# EAGLE schematic TD4SMD (EAGLE 8.0.2)
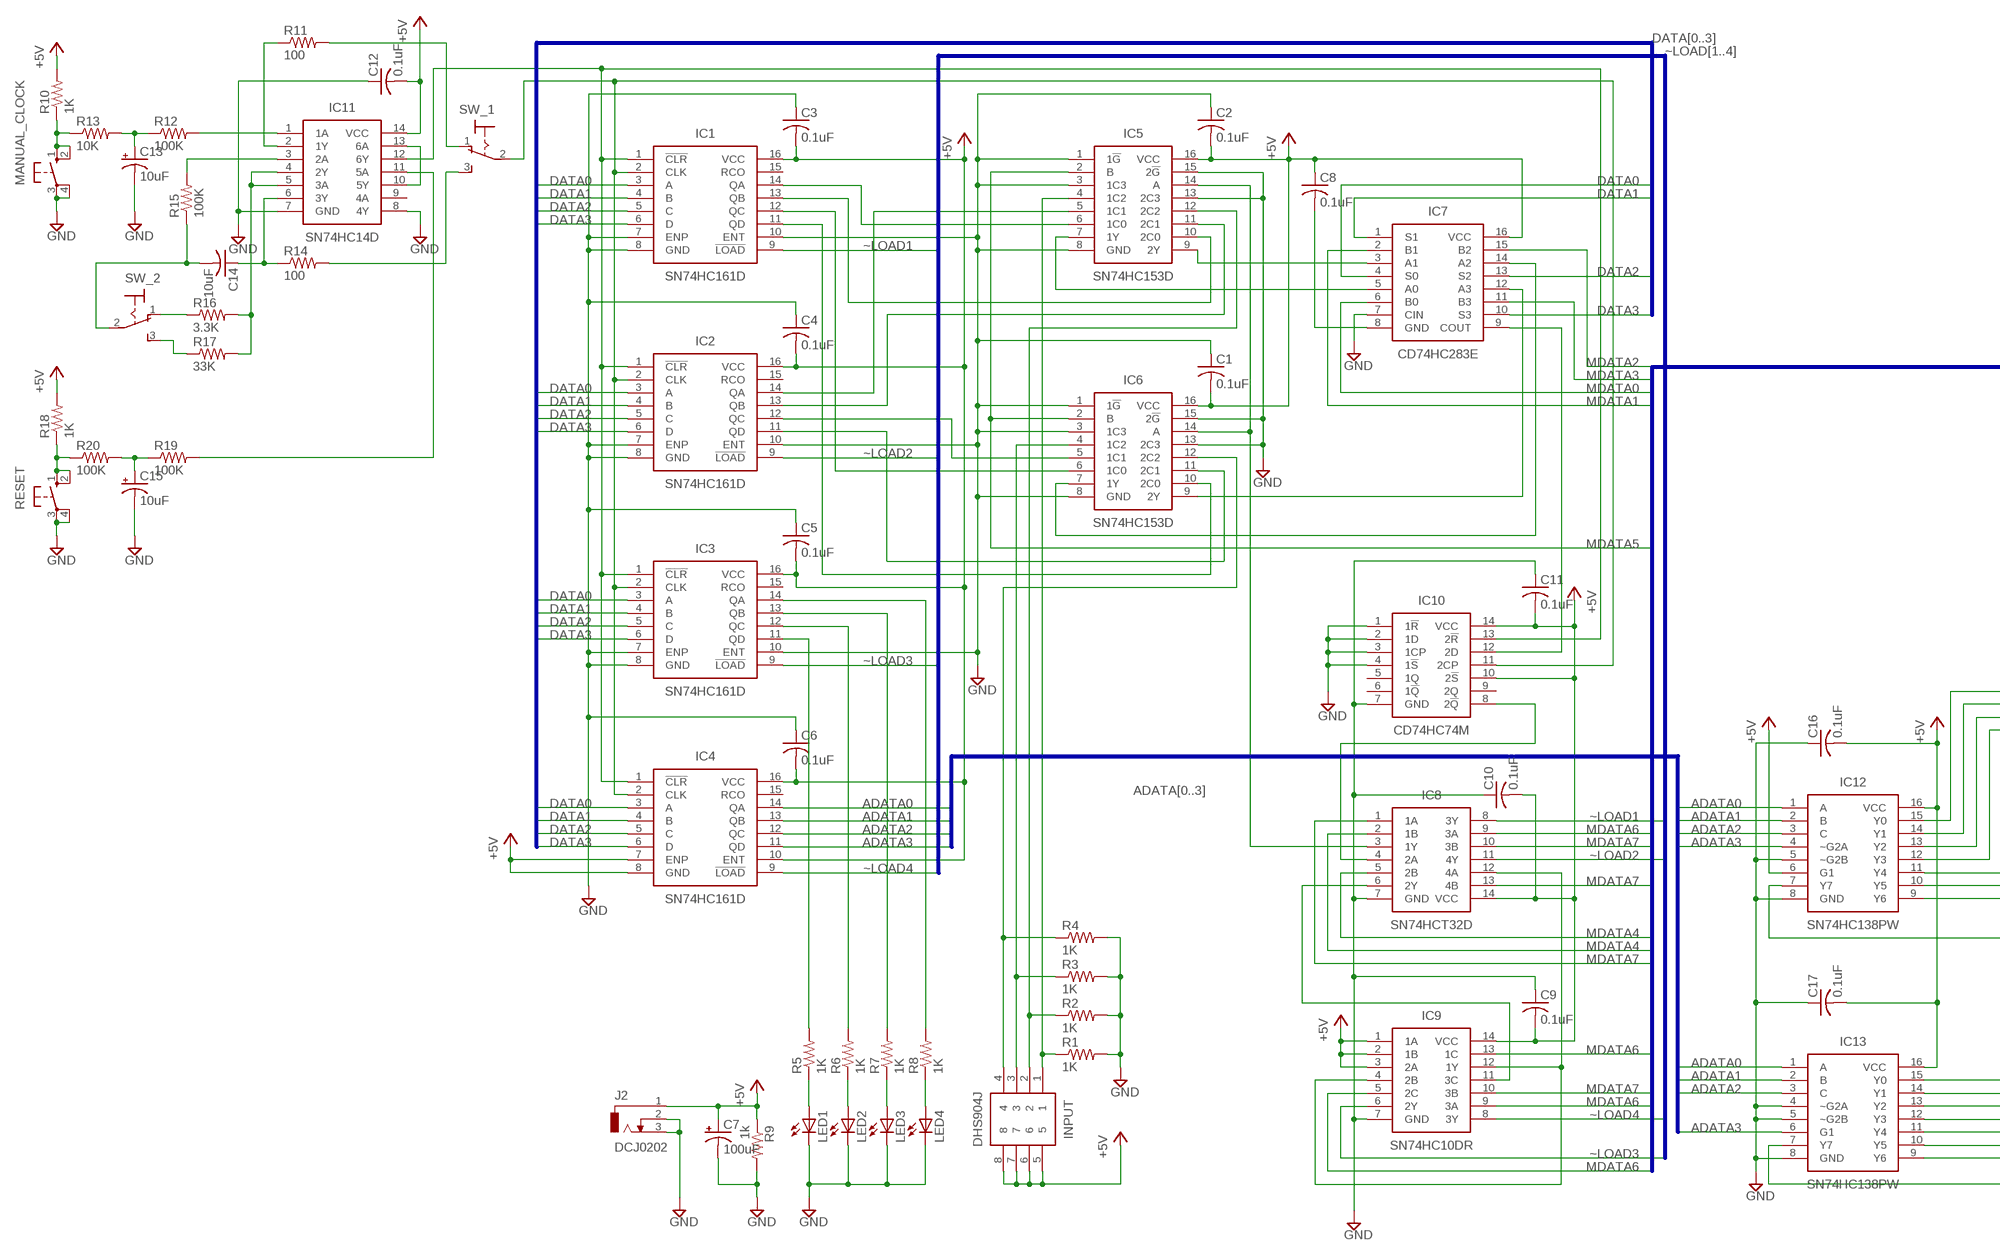
[diagram p0: schematic, sheet 1, part 1 of 2]
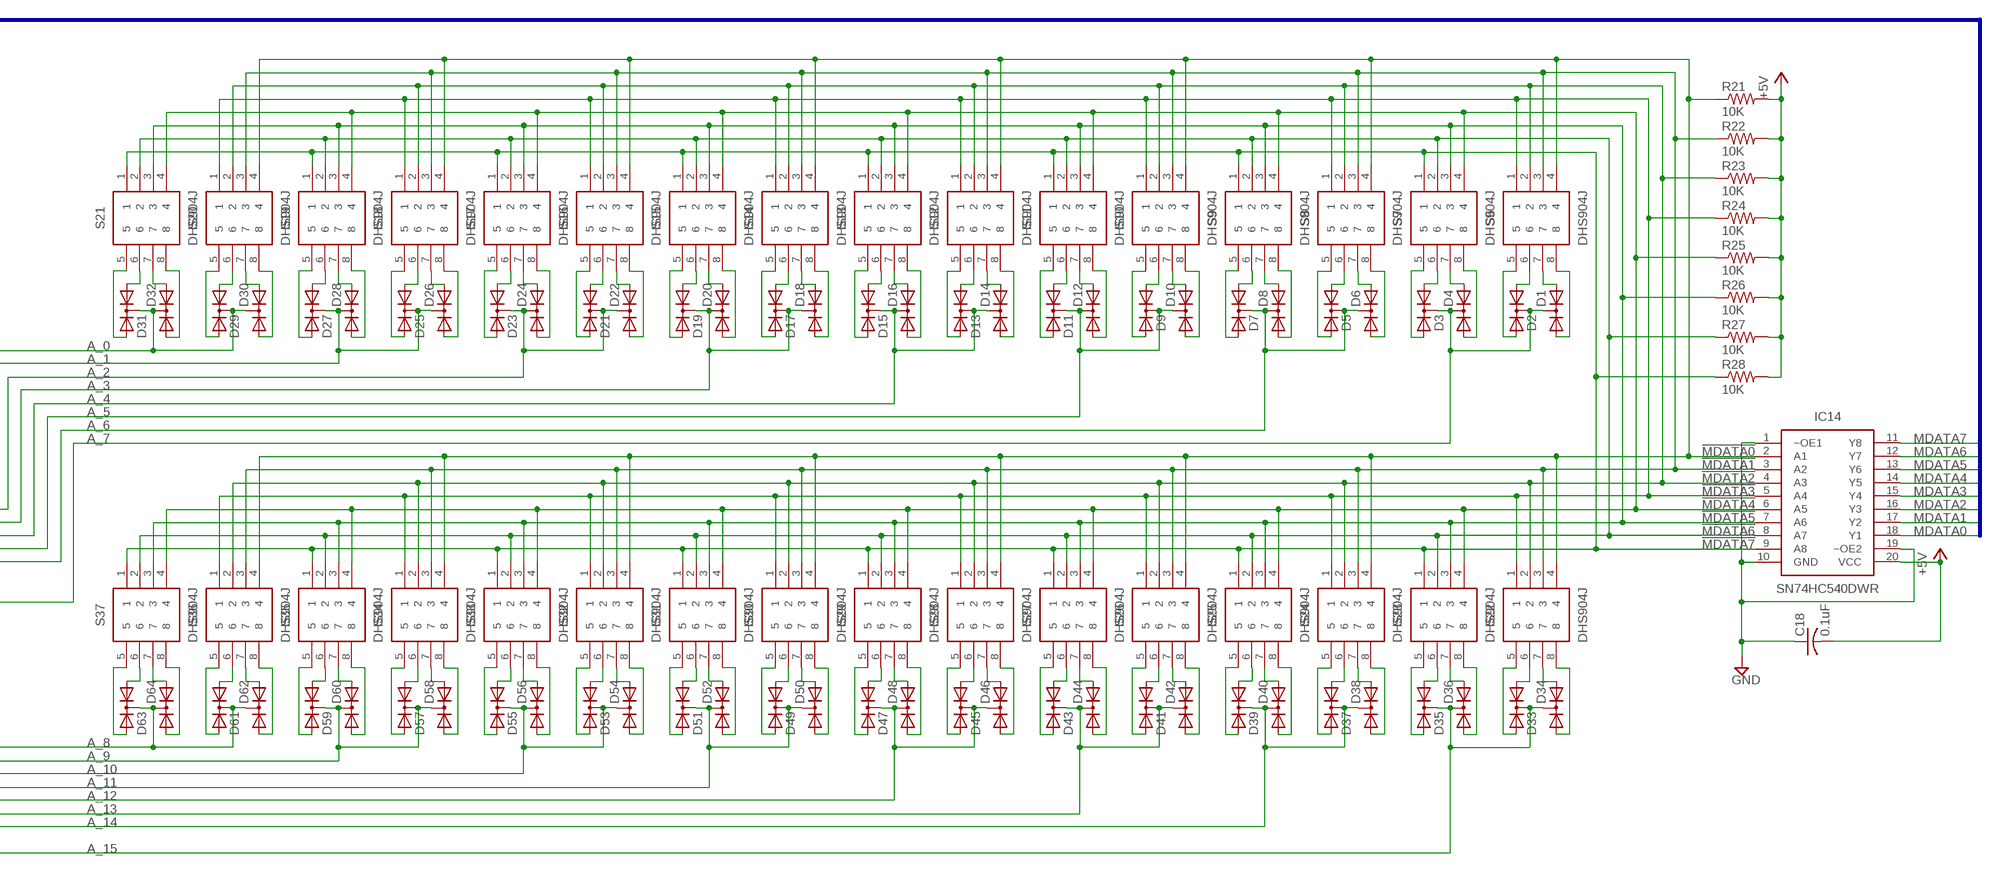
[diagram p1: schematic, sheet 1, part 2 of 2]

## Parts
C1  0.1uF  C-USC0603  [C0603]
C2  0.1uF  C-USC0603  [C0603]
C3  0.1uF  C-USC0603  [C0603]
C4  0.1uF  C-USC0603  [C0603]
C5  0.1uF  C-USC0603  [C0603]
C6  0.1uF  C-USC0603  [C0603]
C7  100uF  CPOL-USE2.5-7  [E2,5-7]
C8  0.1uF  C-USC0603  [C0603]
C9  0.1uF  C-USC0603  [C0603]
C10  0.1uF  C-USC0603  [C0603]
C11  0.1uF  C-USC0603  [C0603]
C12  0.1uF  C-USC0603  [C0603]
C13  10uF  CPOL-USE2.5-7  [E2,5-7]
C14  10uF  C-US025-060X050  [C025-060X050]
C15  10uF  CPOL-USE2.5-7  [E2,5-7]
C16  0.1uF  C-USC0603  [C0603]
C17  0.1uF  C-USC0603  [C0603]
C18  0.1uF  C-USC0603  [C0603]
D1  DIODE-2AC|CASOT23  [SOT23]
D2  DIODE-2AC|CASOT23  [SOT23]
D3  DIODE-2AC|CASOT23  [SOT23]
D4  DIODE-2AC|CASOT23  [SOT23]
D5  DIODE-2AC|CASOT23  [SOT23]
D6  DIODE-2AC|CASOT23  [SOT23]
D7  DIODE-2AC|CASOT23  [SOT23]
D8  DIODE-2AC|CASOT23  [SOT23]
D9  DIODE-2AC|CASOT23  [SOT23]
D10  DIODE-2AC|CASOT23  [SOT23]
D11  DIODE-2AC|CASOT23  [SOT23]
D12  DIODE-2AC|CASOT23  [SOT23]
D13  DIODE-2AC|CASOT23  [SOT23]
D14  DIODE-2AC|CASOT23  [SOT23]
D15  DIODE-2AC|CASOT23  [SOT23]
D16  DIODE-2AC|CASOT23  [SOT23]
D17  DIODE-2AC|CASOT23  [SOT23]
D18  DIODE-2AC|CASOT23  [SOT23]
D19  DIODE-2AC|CASOT23  [SOT23]
D20  DIODE-2AC|CASOT23  [SOT23]
D21  DIODE-2AC|CASOT23  [SOT23]
D22  DIODE-2AC|CASOT23  [SOT23]
D23  DIODE-2AC|CASOT23  [SOT23]
D24  DIODE-2AC|CASOT23  [SOT23]
D25  DIODE-2AC|CASOT23  [SOT23]
D26  DIODE-2AC|CASOT23  [SOT23]
D27  DIODE-2AC|CASOT23  [SOT23]
D28  DIODE-2AC|CASOT23  [SOT23]
D29  DIODE-2AC|CASOT23  [SOT23]
D30  DIODE-2AC|CASOT23  [SOT23]
D31  DIODE-2AC|CASOT23  [SOT23]
D32  DIODE-2AC|CASOT23  [SOT23]
D33  DIODE-2AC|CASOT23  [SOT23]
D34  DIODE-2AC|CASOT23  [SOT23]
D35  DIODE-2AC|CASOT23  [SOT23]
D36  DIODE-2AC|CASOT23  [SOT23]
D37  DIODE-2AC|CASOT23  [SOT23]
D38  DIODE-2AC|CASOT23  [SOT23]
D39  DIODE-2AC|CASOT23  [SOT23]
D40  DIODE-2AC|CASOT23  [SOT23]
D41  DIODE-2AC|CASOT23  [SOT23]
D42  DIODE-2AC|CASOT23  [SOT23]
D43  DIODE-2AC|CASOT23  [SOT23]
D44  DIODE-2AC|CASOT23  [SOT23]
D45  DIODE-2AC|CASOT23  [SOT23]
D46  DIODE-2AC|CASOT23  [SOT23]
D47  DIODE-2AC|CASOT23  [SOT23]
D48  DIODE-2AC|CASOT23  [SOT23]
D49  DIODE-2AC|CASOT23  [SOT23]
D50  DIODE-2AC|CASOT23  [SOT23]
D51  DIODE-2AC|CASOT23  [SOT23]
D52  DIODE-2AC|CASOT23  [SOT23]
D53  DIODE-2AC|CASOT23  [SOT23]
D54  DIODE-2AC|CASOT23  [SOT23]
D55  DIODE-2AC|CASOT23  [SOT23]
D56  DIODE-2AC|CASOT23  [SOT23]
D57  DIODE-2AC|CASOT23  [SOT23]
D58  DIODE-2AC|CASOT23  [SOT23]
D59  DIODE-2AC|CASOT23  [SOT23]
D60  DIODE-2AC|CASOT23  [SOT23]
D61  DIODE-2AC|CASOT23  [SOT23]
D62  DIODE-2AC|CASOT23  [SOT23]
D63  DIODE-2AC|CASOT23  [SOT23]
D64  DIODE-2AC|CASOT23  [SOT23]
IC1  SN74HC161D  [SOIC127P600X175-16N]
IC2  SN74HC161D  [SOIC127P600X175-16N]
IC3  SN74HC161D  [SOIC127P600X175-16N]
IC4  SN74HC161D  [SOIC127P600X175-16N]
IC5  SN74HC153D  [SOIC127P600X175-16N]
IC6  SN74HC153D  [SOIC127P600X175-16N]
IC7  CD74HC283E  [DIP794W53P254L1930H508Q16N]
IC8  SN74HCT32D  [SOIC127P600X175-14N]
IC9  SN74HC10DR  [SOIC127P600X175-14N]
IC10  CD74HC74M  [SOIC127P600X175-14N]
IC11  SN74HC14D  [SOIC127P600X175-14N]
IC12  SN74HC138PW  [SOP65P640X120-16N]
IC13  SN74HC138PW  [SOP65P640X120-16N]
IC14  SN74HC540DWR  [SOIC127P1030X265-20N]
INPUT  DHS904J  [DHS904J]
J2  DCJ0202  [DCJ0202]
LED1  LEDCHIP-LED0603  [CHIP-LED0603]
LED2  LEDCHIP-LED0603  [CHIP-LED0603]
LED3  LEDCHIP-LED0603  [CHIP-LED0603]
LED4  LEDCHIP-LED0603  [CHIP-LED0603]
MANUAL_CLOCK  10-XX  [B3F-10XX]
R1  1K  R-US_R0805  [R0805]
R2  1K  R-US_R0805  [R0805]
R3  1K  R-US_R0805  [R0805]
R4  1K  R-US_R0805  [R0805]
R5  1K  R-US_R0805  [R0805]
R6  1K  R-US_R0805  [R0805]
R7  1K  R-US_R0805  [R0805]
R8  1K  R-US_R0805  [R0805]
R9  1k  R-US_R0805  [R0805]
R10  1K  R-US_R0805  [R0805]
R11  100  R-US_R0805  [R0805]
R12  100K  R-US_R0805  [R0805]
R13  10K  R-US_R0805  [R0805]
R14  100  R-US_R0805  [R0805]
R15  100K  R-US_R0805  [R0805]
R16  3.3K  R-US_R0805  [R0805]
R17  33K  R-US_R0805  [R0805]
R18  1K  R-US_R0805  [R0805]
R19  100K  R-US_R0805  [R0805]
R20  100K  R-US_R0805  [R0805]
R21  10K  R-US_R0805  [R0805]
R22  10K  R-US_R0805  [R0805]
R23  10K  R-US_R0805  [R0805]
R24  10K  R-US_R0805  [R0805]
R25  10K  R-US_R0805  [R0805]
R26  10K  R-US_R0805  [R0805]
R27  10K  R-US_R0805  [R0805]
R28  10K  R-US_R0805  [R0805]
RESET  10-XX  [B3F-10XX]
S6  DHS904J  [DHS904J]
S7  DHS904J  [DHS904J]
S8  DHS904J  [DHS904J]
S9  DHS904J  [DHS904J]
S10  DHS904J  [DHS904J]
S11  DHS904J  [DHS904J]
S12  DHS904J  [DHS904J]
S13  DHS904J  [DHS904J]
S14  DHS904J  [DHS904J]
S15  DHS904J  [DHS904J]
S16  DHS904J  [DHS904J]
S17  DHS904J  [DHS904J]
S18  DHS904J  [DHS904J]
S19  DHS904J  [DHS904J]
S20  DHS904J  [DHS904J]
S21  DHS904J  [DHS904J]
S22  DHS904J  [DHS904J]
S23  DHS904J  [DHS904J]
S24  DHS904J  [DHS904J]
S25  DHS904J  [DHS904J]
S26  DHS904J  [DHS904J]
S27  DHS904J  [DHS904J]
S28  DHS904J  [DHS904J]
S29  DHS904J  [DHS904J]
S30  DHS904J  [DHS904J]
S31  DHS904J  [DHS904J]
S32  DHS904J  [DHS904J]
S33  DHS904J  [DHS904J]
S34  DHS904J  [DHS904J]
S35  DHS904J  [DHS904J]
S36  DHS904J  [DHS904J]
S37  DHS904J  [DHS904J]
SW_1  320-916  [320-916]
SW_2  320-916  [320-916]

## Nets
!MDATA0: IC14.2(A1) R21.1 S6.4 S8.4 S10.4 S12.4 S14.4 S16.4 S18.4 S20.4 S22.4 S24.4 S26.4 S28.4 S30.4 S32.4 S34.4 S36.4
!MDATA1: IC14.3(A2) R22.1 S6.3 S8.3 S10.3 S12.3 S14.3 S16.3 S18.3 S20.3 S22.3 S24.3 S26.3 S28.3 S30.3 S32.3 S34.3 S36.3
!MDATA2: IC14.4(A3) R23.1 S6.2 S8.2 S10.2 S12.2 S14.2 S16.2 S18.2 S20.2 S22.2 S24.2 S26.2 S28.2 S30.2 S32.2 S34.2 S36.2
!MDATA3: IC14.5(A4) R24.1 S6.1 S8.1 S10.1 S12.1 S14.1 S16.1 S18.1 S20.1 S22.1 S24.1 S26.1 S28.1 S30.1 S32.1 S34.1 S36.1
!MDATA4: IC14.6(A5) R25.1 S7.4 S9.4 S11.4 S13.4 S15.4 S17.4 S19.4 S21.4 S23.4 S25.4 S27.4 S29.4 S31.4 S33.4 S35.4 S37.4
!MDATA5: IC14.7(A6) R26.1 S7.3 S9.3 S11.3 S13.3 S15.3 S17.3 S19.3 S21.3 S23.3 S25.3 S27.3 S29.3 S31.3 S33.3 S35.3 S37.3
!MDATA6: IC14.8(A7) R27.1 S7.2 S9.2 S11.2 S13.2 S15.2 S17.2 S19.2 S21.2 S23.2 S25.2 S27.2 S29.2 S31.2 S33.2 S35.2 S37.2
!MDATA7: IC14.9(A8) R28.1 S7.1 S9.1 S11.1 S13.1 S15.1 S17.1 S19.1 S21.1 S23.1 S25.1 S27.1 S29.1 S31.1 S33.1 S35.1 S37.1
+5V [Power]: C1.2 C2.2 C3.2 C4.2 C5.2 C6.2 C7.+ C8.1 C9.2 C10.2 C11.2 C12.2 C16.2 C17.2 C18.2 IC1.16(VCC) IC2.16(VCC) IC3.16(VCC) IC4.7(ENP) IC4.8(GND) IC4.10(ENT) IC4.16(VCC) IC5.16(VCC) IC6.16(VCC) IC7.16(VCC) IC8.14(VCC) IC9.1(1A) IC9.2(1B) IC9.3(2A) IC9.14(VCC) IC10.10(2!S) IC10.14(VCC) IC11.14(VCC) IC12.6(G1) IC12.16(VCC) IC13.16(VCC) IC14.20(VCC) INPUT.5 INPUT.6 INPUT.7 INPUT.8 J2.1 R9.1 R10.2 R18.2 R21.2 R22.2 R23.2 R24.2 R25.2 R26.2 R27.2 R28.2
A_0: D29.3(C) D30.3(C) D31.3(C) D32.3(C) IC12.15(Y0)
A_1: D25.3(C) D26.3(C) D27.3(C) D28.3(C) IC12.14(Y1)
A_2: D21.3(C) D22.3(C) D23.3(C) D24.3(C) IC12.13(Y2)
A_3: D17.3(C) D18.3(C) D19.3(C) D20.3(C) IC12.12(Y3)
A_4: D13.3(C) D14.3(C) D15.3(C) D16.3(C) IC12.11(Y4)
A_5: D9.3(C) D10.3(C) D11.3(C) D12.3(C) IC12.10(Y5)
A_6: D5.3(C) D6.3(C) D7.3(C) D8.3(C) IC12.9(Y6)
A_7: D1.3(C) D2.3(C) D3.3(C) D4.3(C) IC12.7(Y7)
A_8: D61.3(C) D62.3(C) D63.3(C) D64.3(C) IC13.15(Y0)
A_9: D57.3(C) D58.3(C) D59.3(C) D60.3(C) IC13.14(Y1)
A_10: D53.3(C) D54.3(C) D55.3(C) D56.3(C) IC13.13(Y2)
A_11: D49.3(C) D50.3(C) D51.3(C) D52.3(C) IC13.12(Y3)
A_12: D45.3(C) D46.3(C) D47.3(C) D48.3(C) IC13.11(Y4)
A_13: D41.3(C) D42.3(C) D43.3(C) D44.3(C) IC13.10(Y5)
A_14: D37.3(C) D38.3(C) D39.3(C) D40.3(C) IC13.9(Y6)
A_15: D33.3(C) D34.3(C) D35.3(C) D36.3(C) IC13.7(Y7)
ADATA0: IC4.14(QA) IC12.1(A) IC13.1(A)
ADATA1: IC4.13(QB) IC12.2(B) IC13.2(B)
ADATA2: IC4.12(QC) IC12.3(C) IC13.3(C)
ADATA3: IC4.11(QD) IC12.4(~G2A) IC13.6(G1)
DATA0: IC1.3(A) IC2.3(A) IC3.3(A) IC4.3(A) IC7.4(S0)
DATA1: IC1.4(B) IC2.4(B) IC3.4(B) IC4.4(B) IC7.1(S1)
DATA2: IC1.5(C) IC2.5(C) IC3.5(C) IC4.5(C) IC7.13(S2)
DATA3: IC1.6(D) IC2.6(D) IC3.6(D) IC4.6(D) IC7.10(S3)
GND [Power]: C1.1 C2.1 C3.1 C4.1 C5.1 C6.1 C7.- C9.1 C10.1 C11.1 C12.1 C13.- C15.- C16.1 C17.1 C18.1 IC1.7(ENP) IC1.8(GND) IC1.10(ENT) IC2.7(ENP) IC2.8(GND) IC2.10(ENT) IC3.7(ENP) IC3.8(GND) IC3.10(ENT) IC5.1(1!G) IC5.3(1C3) IC5.8(GND) IC5.13(2C3) IC5.15(2!G) IC6.1(1!G) IC6.3(1C3) IC6.8(GND) IC6.13(2C3) IC6.15(2!G) IC7.7(CIN) IC8.7(GND) IC9.7(GND) IC10.1(1!R) IC10.2(1D) IC10.3(1CP) IC10.4(1!S) IC10.7(GND) IC11.7(GND) IC11.8(4Y) IC12.5(~G2B) IC12.8(GND) IC13.4(~G2A) IC13.5(~G2B) IC13.8(GND) IC14.1(~OE1) IC14.10(GND) IC14.19(~OE2) J2.2 J2.3 LED1.C LED2.C LED3.C LED4.C MANUAL_CLOCK.3(P) MANUAL_CLOCK.4(P1) R1.2 R2.2 R3.2 R4.2 R9.2 RESET.3(P) RESET.4(P1)
MDATA0: IC7.6(B0) IC14.18(Y1)
MDATA1: IC7.2(B1) IC14.17(Y2)
MDATA2: IC7.15(B2) IC14.16(Y3)
MDATA3: IC7.11(B3) IC14.15(Y4)
MDATA4: IC8.2(1B) IC8.5(2B) IC14.14(Y5)
MDATA5: IC5.2(B) IC6.2(B) IC14.13(Y6)
MDATA6: IC8.9(3A) IC9.5(2C) IC9.9(3A) IC9.13(1C) IC14.12(Y7)
MDATA7: IC8.1(1A) IC8.10(3B) IC8.13(4B) IC9.10(3B) IC14.11(Y8)
N$1: IC1.14(QA) IC5.6(1C0)
N$2: IC1.13(QB) IC5.10(2C0)
N$3: IC1.12(QC) IC6.6(1C0)
N$4: IC6.7(1Y) IC7.14(A2)
N$5: IC5.4(1C2) INPUT.1 R1.1
N$6: IC5.12(2C2) INPUT.2 R2.1
N$7: IC6.4(1C2) INPUT.3 R3.1
N$8: IC6.12(2C2) INPUT.4 R4.1
N$9: MANUAL_CLOCK.1(S) MANUAL_CLOCK.2(S1) R10.1 R13.1
N$10: IC2.14(QA) IC5.5(1C1)
N$11: IC2.13(QB) IC5.11(2C1)
N$12: IC2.11(QD) IC6.11(2C1)
N$13: IC2.12(QC) IC6.5(1C1)
N$14: IC3.11(QD) R5.2
N$15: IC3.12(QC) R6.2
N$16: IC3.13(QB) R7.2
N$17: IC3.14(QA) R8.2
N$18: LED1.A R5.1
N$19: LED2.A R6.1
N$20: LED3.A R7.1
N$21: LED4.A R8.1
N$22: IC1.11(QD) IC6.10(2C0)
N$23: IC5.7(1Y) IC7.5(A0)
N$24: IC1.1(!CLR) IC2.1(!CLR) IC3.1(!CLR) IC4.1(!CLR) IC10.13(2!R) IC11.12(6Y)
N$25: IC1.2(CLK) IC2.2(CLK) IC3.2(CLK) IC4.2(CLK) IC10.11(2CP) SW_1.2(P)
N$26: IC5.9(2Y) IC7.3(A1)
N$27: IC8.12(4A) IC9.4(2B) IC9.12(1Y)
N$28: IC6.9(2Y) IC7.12(A3)
N$29: IC5.14(A) IC6.14(A) IC8.3(1Y)
N$30: C8.2 IC7.8(GND)
N$31: IC8.4(2A) IC10.8(2!Q)
N$32: IC8.6(2Y) IC9.11(3C)
N$33: IC7.9(COUT) IC10.12(2D)
N$36: IC11.2(1Y) R11.1
N$37: R11.2 SW_1.1(O)
N$38: C13.+ R12.1 R13.2
N$39: IC11.1(1A) R12.2
N$40: R14.2 SW_1.3(S)
N$41: C14.1 IC11.6(3Y) R14.1
N$42: C14.2 R15.1 SW_2.2(P)
N$43: IC11.3(2A) R15.2
N$44: IC11.4(2Y) IC11.5(3A) R16.2 R17.2
N$45: R16.1 SW_2.1(O)
N$46: R17.1 SW_2.3(S)
N$47: IC11.10(5Y) IC11.13(6A)
N$48: IC11.11(5A) R19.2
N$49: R18.1 R20.1 RESET.1(S) RESET.2(S1)
N$50: C15.+ R19.1 R20.2
N$51: D2.2(A2) S6.5
N$52: D2.1(A1) S6.6
N$53: D1.2(A2) S6.7
N$54: D1.1(A1) S6.8
N$55: D5.2(A2) S8.5
N$56: D4.2(A2) S7.7
N$57: D3.1(A1) S7.6
N$58: D3.2(A2) S7.5
N$59: D5.1(A1) S8.6
N$60: D6.2(A2) S8.7
N$61: D6.1(A1) S8.8
N$62: D8.2(A2) S9.7
N$63: D7.1(A1) S9.6
N$64: D7.2(A2) S9.5
N$65: D8.1(A1) S9.8
N$66: D9.2(A2) S10.5
N$67: D9.1(A1) S10.6
N$68: D4.1(A1) S7.8
N$69: D10.2(A2) S10.7
N$70: D10.1(A1) S10.8
N$71: D12.2(A2) S11.7
N$72: D11.1(A1) S11.6
N$73: D11.2(A2) S11.5
N$74: D12.1(A1) S11.8
N$75: D13.2(A2) S12.5
N$76: D13.1(A1) S12.6
N$77: D14.2(A2) S12.7
N$78: D14.1(A1) S12.8
N$79: D16.2(A2) S13.7
N$80: D15.1(A1) S13.6
N$81: D15.2(A2) S13.5
N$82: D16.1(A1) S13.8
N$83: D17.2(A2) S14.5
N$84: D17.1(A1) S14.6
N$85: D18.2(A2) S14.7
N$86: D18.1(A1) S14.8
N$87: D20.2(A2) S15.7
N$88: D19.1(A1) S15.6
N$89: D19.2(A2) S15.5
N$90: D20.1(A1) S15.8
N$91: D33.2(A2) S22.5
N$92: D21.2(A2) S16.5
N$93: D21.1(A1) S16.6
N$94: D22.2(A2) S16.7
N$95: D22.1(A1) S16.8
N$96: D24.2(A2) S17.7
N$97: D23.1(A1) S17.6
N$98: D23.2(A2) S17.5
N$99: D24.1(A1) S17.8
N$101: D25.2(A2) S18.5
N$102: D25.1(A1) S18.6
N$103: D26.2(A2) S18.7
N$104: D26.1(A1) S18.8
N$105: D28.2(A2) S19.7
N$106: D27.1(A1) S19.6
N$107: D27.2(A2) S19.5
N$108: D28.1(A1) S19.8
N$109: D29.2(A2) S20.5
N$110: D29.1(A1) S20.6
N$111: D30.2(A2) S20.7
N$112: D30.1(A1) S20.8
N$113: D32.2(A2) S21.7
N$114: D31.1(A1) S21.6
N$115: D31.2(A2) S21.5
N$116: D32.1(A1) S21.8
N$117: D33.1(A1) S22.6
N$118: D34.2(A2) S22.7
N$119: D34.1(A1) S22.8
N$120: D36.2(A2) S23.7
N$121: D35.1(A1) S23.6
N$122: D35.2(A2) S23.5
N$123: D36.1(A1) S23.8
N$124: D37.2(A2) S24.5
N$125: D37.1(A1) S24.6
N$126: D38.2(A2) S24.7
N$127: D38.1(A1) S24.8
N$128: D40.2(A2) S25.7
N$129: D39.1(A1) S25.6
N$130: D39.2(A2) S25.5
N$131: D40.1(A1) S25.8
N$132: D41.2(A2) S26.5
N$133: D41.1(A1) S26.6
N$134: D42.2(A2) S26.7
N$135: D42.1(A1) S26.8
N$136: D44.2(A2) S27.7
N$137: D43.1(A1) S27.6
N$138: D43.2(A2) S27.5
N$139: D44.1(A1) S27.8
N$140: D45.2(A2) S28.5
N$141: D45.1(A1) S28.6
N$142: D46.2(A2) S28.7
N$143: D46.1(A1) S28.8
N$144: D48.2(A2) S29.7
N$145: D47.1(A1) S29.6
N$146: D47.2(A2) S29.5
N$147: D48.1(A1) S29.8
N$148: D49.2(A2) S30.5
N$149: D49.1(A1) S30.6
N$150: D50.2(A2) S30.7
N$151: D50.1(A1) S30.8
N$152: D52.2(A2) S31.7
N$153: D51.1(A1) S31.6
N$154: D51.2(A2) S31.5
N$155: D52.1(A1) S31.8
N$156: D53.2(A2) S32.5
N$157: D53.1(A1) S32.6
N$158: D54.2(A2) S32.7
N$159: D54.1(A1) S32.8
N$160: D56.2(A2) S33.7
N$161: D55.1(A1) S33.6
N$162: D55.2(A2) S33.5
N$163: D56.1(A1) S33.8
N$164: D57.2(A2) S34.5
N$165: D57.1(A1) S34.6
N$166: D58.2(A2) S34.7
N$167: D58.1(A1) S34.8
N$168: D60.2(A2) S35.7
N$169: D59.1(A1) S35.6
N$170: D59.2(A2) S35.5
N$171: D60.1(A1) S35.8
N$172: D61.2(A2) S36.5
N$173: D61.1(A1) S36.6
N$174: D62.2(A2) S36.7
N$175: D62.1(A1) S36.8
N$176: D64.2(A2) S37.7
N$177: D63.1(A1) S37.6
N$178: D63.2(A2) S37.5
N$179: D64.1(A1) S37.8
~LOAD1: IC1.9(!LOAD) IC8.8(3Y)
~LOAD2: IC2.9(!LOAD) IC8.11(4Y)
~LOAD3: IC3.9(!LOAD) IC9.6(2Y)
~LOAD4: IC4.9(!LOAD) IC9.8(3Y)
Unconnected: IC1.15(RCO) IC2.15(RCO) IC3.15(RCO) IC4.15(RCO) IC10.5(1Q) IC10.6(1!Q) IC10.9(2Q) IC11.9(4A)

## Buses
DATA[0..3]
~LOAD[1..4]
ADATA[0..3]
MDATA[0..7]

## Library data of the parts
C1-C6 C8-C12 C14 C16-C18 = rcl:C-US: CAPACITOR, American symbol
C7 C13 C15 = rcl:CPOL-US: POLARIZED CAPACITOR, American symbol
D1-D64 = diode:DIODE-2AC|CA: Dual DIODE Anode-Cathode|Cathode-Anode
IC1-IC4 = SamacSys_Parts:SN74HC161D: SN74HC161D <https://componentsearchengine.com/Images/3/SN74HC161D.gif> Source: Datasheet <http://www.ti.com/lit/ds/symlink/sn74hc161.pdf>; DESCRIPTION: SN74HC161D; HEIGHT: 1.75mm; MANUFACTURER_NAME: Texas Instruments; MANUFACTURER_PART_NUMBER: SN74HC161D; RS_PART_NUMBER: 6631969; SUPPLIER_NAME: RS
IC5 IC6 = SamacSys_Parts:SN74HC153D: SN74HC153D, Multiplexer Dual 4:1, 16-Pin, SOIC <https://componentsearchengine.com/Images/3/SN74HC153D.gif> Source: Datasheet <http://www.ti.com/lit/ds/symlink/sn74hc153.pdf>; DESCRIPTION: SN74HC153D, Multiplexer Dual 4:1, 16-Pin, SOIC; HEIGHT: 1.75mm; MANUFACTURER_NAME: Texas Instruments; MANUFACTURER_PART_NUMBER: SN74HC153D; RS_PART_NUMBER: 6631944; SUPPLIER_NAME: RS
IC7 = SamacSys_Parts:CD74HC283E: CD74HC283E, 4-Bit Binary Full Adder, HC, 2 6 V 16-Pin PDIP <https://componentsearchengine.com/Images/3/CD74HC283E.jpg> Source: Datasheet <http://www.ti.com/lit/ds/symlink/cd74hc283.pdf>; DESCRIPTION: CD74HC283E, 4-Bit Binary Full Adder, HC, 2 6 V 16-Pin PDIP; HEIGHT: 5.08mm; MANUFACTURER_NAME: Texas Instruments; MANUFACTURER_PART_NUMBER: CD74HC283E; RS_PART_NUMBER: 6630231; SUPPLIER_NAME: RS
IC8 = SamacSys_Parts:SN74HCT32D: Texas Instruments SN74HCT32D, Quad 2-Input OR Logic Gate, 4.5 5.5 V, 14-Pin SOIC <http://uk.rs-online.com/largeimages/W0526167-01.jpg> Source: Datasheet; DESCRIPTION: Texas Instruments SN74HCT32D, Quad 2-Input OR Logic Gate, 4.5 5.5 V, 14-Pin SOIC; HEIGHT: mm; MANUFACTURER_NAME: Texas Instruments; MANUFACTURER_PART_NUMBER: SN74HCT32D; RS_PART_NUMBER: 0526167; SUPPLIER_NAME: RS
IC9 = SamacSys_Parts:SN74HC10DR: SN74HC10DR, Logic Gate Triple 3 Input NAND, HC, 5.2mA 2 ??? 6 V 14-Pin SOIC <https://componentsearchengine.com/Images/3/SN74HC10DR.jpg> Source: Datasheet <http://www.ti.com/lit/ds/symlink/sn74hc10.pdf>; DESCRIPTION: SN74HC10DR, Logic Gate Triple 3 Input NAND, HC, 5.2mA 2 ??? 6 V 14-Pin SOIC; HEIGHT: 1.75mm; MANUFACTURER_NAME: Texas Instruments; MANUFACTURER_PART_NUMBER: SN74HC10DR; RS_PART_NUMBER: 6628089; SUPPLIER_NAME: RS
IC10 = SamacSys_Parts:CD74HC74M: CD74HC74M, Dual D Type Flip Flop HC, 2 to 6V 14-Pin SOIC <https://componentsearchengine.com/Images/3/CD74HC74M.jpg> Source: Datasheet <http://docs-europe.electrocomponents.com/webdocs/0b76/0900766b80b764b0.pdf>; DESCRIPTION: CD74HC74M, Dual D Type Flip Flop HC, 2 to 6V 14-Pin SOIC; HEIGHT: 1.75mm; MANUFACTURER_NAME: Texas Instruments; MANUFACTURER_PART_NUMBER: CD74HC74M; RS_PART_NUMBER: 0527675; SUPPLIER_NAME: RS
IC11 = SamacSys_Parts:SN74HC14D: SN74HC14D, Hex Schmitt Trigger Inverter, HC, 5.2mA 2 to 6V 14-Pin SOIC <https://componentsearchengine.com/Images/3/SN74HC14D.gif> Source: Datasheet <http://www.ti.com/lit/ds/symlink/sn74hc14.pdf>; DESCRIPTION: SN74HC14D, Hex Schmitt Trigger Inverter, HC, 5.2mA 2 to 6V 14-Pin SOIC; HEIGHT: 1.75mm; MANUFACTURER_NAME: Texas Instruments; MANUFACTURER_PART_NUMBER: SN74HC14D; RS_PART_NUMBER: 4368423; SUPPLIER_NAME: RS
IC12 IC13 = SamacSys_Parts:SN74HC138PW: Texas Instruments SN74HC138PW, Decoder, Demultiplexer, 1-of-8, Inverting, 2 6 V, 16-Pin TSSOP <https://componentsearchengine.com/Images/3/SN74HC138PW.jpg> Source: Datasheet; DESCRIPTION: Texas Instruments SN74HC138PW, Decoder, Demultiplexer, 1-of-8, Inverting, 2 6 V, 16-Pin TSSOP; HEIGHT: mm; MANUFACTURER_NAME: Texas Instruments; MANUFACTURER_PART_NUMBER: SN74HC138PW; RS_PART_NUMBER: 6631928; SUPPLIER_NAME: RS
IC14 = SamacSys_Parts:SN74HC540DWR: OCTAL BUFFERS AND LINE DRIVERS WITH 3 STATE OUTPUTS Source: Datasheet; DESCRIPTION: OCTAL BUFFERS AND LINE DRIVERS WITH 3 STATE OUTPUTS; HEIGHT: mm; MANUFACTURER_NAME: Texas Instruments; MANUFACTURER_PART_NUMBER: SN74HC540DWR
INPUT S6-S37 = SamacSys_Parts:DHS904J: 4 Way Surface Mount DIP Switch SP-NO <https://componentsearchengine.com/Images/3/DHS904J.jpg> Source: Datasheet <http://docs-europe.electrocomponents.com/webdocs/0e2b/0900766b80e2b79f.pdf>; DESCRIPTION: 4 Way Surface Mount DIP Switch SP-NO; HEIGHT: mm; MANUFACTURER_NAME: KNITTER-SWITCH; MANUFACTURER_PART_NUMBER: DHS904J; RS_PART_NUMBER: 7023653; SUPPLIER_NAME: RS
J2 = con-jack:DCJ0202: DC POWER JACK Source: DCJ0202.pdf; OC_FARNELL: unknown; OC_NEWARK: unknown
LED1-LED4 = led:LED: LED OSRAM: - CHIPLED LG R971, LG N971, LY N971, LG Q971, LY Q971, LO R971, LY R971 LH N974, LH R974 LS Q976, LO Q976, LY Q976 LO Q996 - Hyper CHIPLED LW Q18S LB Q993, LB Q99A, LB R99A - SideLED LS A670, LO A670, LY A670, LG A670, LP A670 LB A673, LV A673, LT A673, LW A673 LH A674 LY A675 LS A676, LA A676, LO A676, LY A676, LW A676 LS A679, LY A679, LG A679 - Hyper Micro SIDELED® LS Y876, LA Y876, LO Y876, LY Y876 LT Y87S - SmartLED LW L88C, LW L88S LB L89C, LB L89S, LG L890 LS L89K, LO L89K, LY L89K LS L896, LA L896, LO L896, LY L896 - TOPLED LS T670, LO T670, LY T670, LG T670, LP T670 LSG T670, LSP T670, LSY T670, LOP T670, LYG T670 LG T671, LOG T671, LSG T671 LB T673, LV T673, LT T673, LW T673 LH T674 LS T676, LA T676, LO T676, LY T676, LB T676, LH T676, LSB T676, LW T676 LB T67C, LV T67C, LT T67C, LS T67K, LO T67K, LY T67K, LW E67C LS E67B, LA E67B, LO E67B, LY E67B, LB E67C, LV E67C, LT E67C LW T67C LS T679, LY T679, LG T679 LS T770, LO T770, LY T770, LG T770, LP T770 LB T773, LV T773, LT T773, LW T773 LH T774 LS E675, LA E675, LY E675, LS T675 LS T776, LA T776, LO T776, LY T776, LB T776 LHGB T686 LT T68C, LB T68C - Hyper Mini TOPLED® LB M676 - Mini TOPLED Santana® LG M470 LS M47K, LO M47K, LY M47K Source: http://www.osram.convergy.de LUXEON: - LUMILED® LXK2-PW12-R00, LXK2-PW12-S00, LXK2-PW14-U00, LXK2-PW14-V00 LXK2-PM12-R00, LXK2-PM12-S00, LXK2-PM14-U00 LXK2-PE12-Q00, LXK2-PE12-R00, LXK2-PE12-S00, LXK2-PE14-T00, LXK2-PE14-U00 LXK2-PB12-K00, LXK2-PB12-L00, LXK2-PB12-M00, LXK2-PB14-N00, LXK2-PB14-P00, LXK2-PB14-Q00 LXK2-PR12-L00, LXK2-PR12-M00, LXK2-PR14-Q00, LXK2-PR14-R00 LXK2-PD12-Q00, LXK2-PD12-R00, LXK2-PD12-S00 LXK2-PH12-R00, LXK2-PH12-S00 LXK2-PL12-P00, LXK2-PL12-Q00, LXK2-PL12-R00 Source: www.luxeon.com KINGBRIGHT: KA-3528ASYC Source: www.kingbright.com
MANUAL_CLOCK RESET = switch-omron:10-XX: OMRON SWITCH; MPN: B3F-1000; OC_FARNELL: 176432; OC_NEWARK: 36M3542
R1-R28 = rcl:R-US_: RESISTOR, American symbol
SW_1 SW_2 = switch:320-916: TOGGLE SWITCH distributor RS Components

## Net classes
0 default: width 0.203 mm, drill 0.203 mm, clearance 0.254 mm
1 Power: width 0.381 mm, drill 0.203 mm, clearance 0.254 mm